# EAGLE schematic gun_sensor (EAGLE 9.2.2)
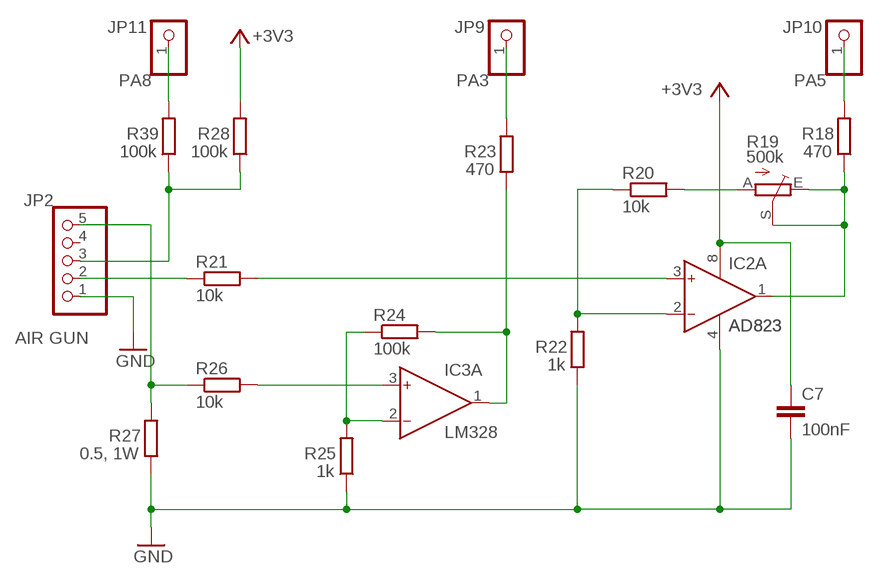
[diagram p0: schematic, sheet 1]

## Parts
C7  100nF  C-EU025-024X044  [C025-024X044]
IC2  AD823  AD822N  [DIL08]
IC3  LM328  AD822N  [DIL08]
JP2  AIR GUN  PINHD-1X5  [1X05]
JP9  PA3  PINHD-1X1  [1X01]
JP10  PA5  PINHD-1X1  [1X01]
JP11  PA8  PINHD-1X1  [1X01]
R18  470  R-EU_0204/5  [0204/5]
R19  500k  TRIM_EU-B64Y  [B64Y]
R20  10k  R-EU_0204/5  [0204/5]
R21  10k  R-EU_0204/5  [0204/5]
R22  1k  R-EU_0204/5  [0204/5]
R23  470  R-EU_0204/5  [0204/5]
R24  100k  R-EU_0204/5  [0204/5]
R25  1k  R-EU_0204/5  [0204/5]
R26  10k  R-EU_0204/5  [0204/5]
R27  0.5, 1W  R-EU_0204/5  [0204/5]
R28  100k  R-EU_0204/5  [0204/5]
R39  100k  R-EU_0204/5  [0204/5]

## Nets
+3V3: C7.1 IC2.8(P:V+) R28.2
GND: C7.2 IC2.4(P:V-) JP2.1 R22.1 R25.1 R27.1
N$1: JP2.5 R26.1 R27.2
N$2: IC3.3(A:IN+) R26.2
N$3: IC3.2(A:IN-) R24.1 R25.2
N$4: IC3.1(A:OUT) R23.1 R24.2
N$5: IC2.3(A:IN+) R21.2
N$6: JP2.2 R21.1
N$7: JP2.3 R28.1 R39.1
N$8: JP9.1 R23.2
N$9: JP10.1 R18.2
N$10: R19.A R20.2
N$11: IC2.1(A:OUT) R18.1 R19.E R19.S
N$12: IC2.2(A:IN-) R20.1 R22.2
N$13: JP11.1 R39.2
Unconnected: IC2.5(B:IN+) IC2.6(B:IN-) IC2.7(B:OUT) IC3.5(B:IN+) IC3.6(B:IN-) IC3.7(B:OUT) JP2.4

## Power pins joined to a net without a drawn wire
V+: IC3.8(P:V+)
V-: IC3.4(P:V-)

## Library data of the parts
C7 = rcl:C-EU: CAPACITOR, European symbol; SPICEPREFIX: C
IC2 IC3 = analog-devices:AD822: Single-Supply, Rail-to-Rail Low Power FET-Input Op Amp Source: http://www.analog.com/static/imported-files/data_sheets/AD822.pdf; OC_FARNELL: 1438581; OC_NEWARK: unknown
JP2 = pinhead:PINHD-1X5: PIN HEADER
JP9-JP11 = pinhead:PINHD-1X1: PIN HEADER
R18 R20-R28 R39 = rcl:R-EU_: RESISTOR, European symbol; SPICEPREFIX: R
R19 = pot:TRIM_EU-: POTENTIOMETER